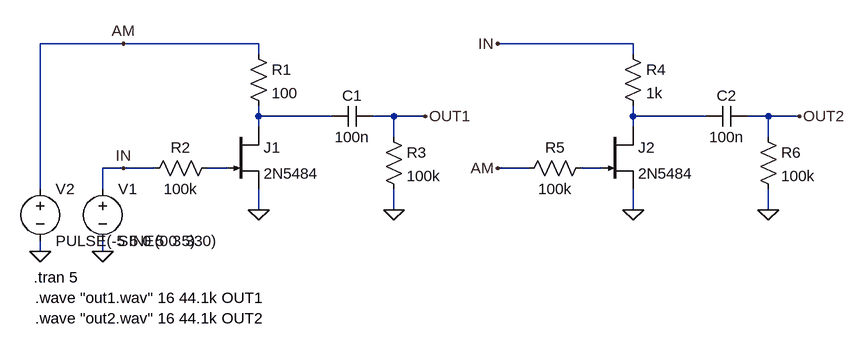
[diagram p0: schematic JFET.asc]
JFET.asc, the LTspice schematic file:
Version 4
SHEET 1 1072 680
WIRE -48 -48 -176 -48
WIRE 160 -48 -48 -48
WIRE 736 -48 528 -48
WIRE 160 -32 160 -48
WIRE 736 -32 736 -48
WIRE 160 64 160 48
WIRE 272 64 160 64
WIRE 368 64 336 64
WIRE 416 64 368 64
WIRE 736 64 736 48
WIRE 848 64 736 64
WIRE 944 64 912 64
WIRE 992 64 944 64
WIRE 160 80 160 64
WIRE 736 80 736 64
WIRE 368 96 368 64
WIRE 944 96 944 64
WIRE -48 144 -80 144
WIRE 0 144 -48 144
WIRE 112 144 80 144
WIRE 576 144 528 144
WIRE 688 144 656 144
WIRE -176 176 -176 -48
WIRE -80 176 -80 144
WIRE 160 208 160 176
WIRE 368 208 368 176
WIRE 736 208 736 176
WIRE 944 208 944 176
WIRE -176 272 -176 256
WIRE -80 272 -80 256
FLAG 160 208 0
FLAG -80 272 0
FLAG -176 272 0
FLAG 416 64 OUT1
FLAG -48 -48 AM
FLAG -48 144 IN
FLAG 368 208 0
FLAG 736 208 0
FLAG 992 64 OUT2
FLAG 528 144 AM
FLAG 528 -48 IN
FLAG 944 208 0
SYMBOL njf 112 80 R0
SYMATTR InstName J1
SYMATTR Value 2N5484
SYMBOL res 144 -48 R0
SYMATTR InstName R1
SYMATTR Value 100
SYMBOL res 96 128 R90
WINDOW 0 0 56 VBottom 2
WINDOW 3 32 56 VTop 2
SYMATTR InstName R2
SYMATTR Value 100k
SYMBOL voltage -80 160 R0
WINDOW 123 0 0 Left 0
WINDOW 39 0 0 Left 0
SYMATTR InstName V1
SYMATTR Value SINE(0 3 330)
SYMBOL voltage -176 160 R0
WINDOW 123 0 0 Left 0
WINDOW 39 0 0 Left 0
SYMATTR InstName V2
SYMATTR Value PULSE(-5 5 0 5 0 5)
SYMBOL cap 336 48 R90
WINDOW 0 0 32 VBottom 2
WINDOW 3 32 32 VTop 2
SYMATTR InstName C1
SYMATTR Value 100n
SYMBOL res 352 80 R0
SYMATTR InstName R3
SYMATTR Value 100k
SYMBOL njf 688 80 R0
SYMATTR InstName J2
SYMATTR Value 2N5484
SYMBOL res 720 -48 R0
SYMATTR InstName R4
SYMATTR Value 1k
SYMBOL res 672 128 R90
WINDOW 0 0 56 VBottom 2
WINDOW 3 32 56 VTop 2
SYMATTR InstName R5
SYMATTR Value 100k
SYMBOL cap 912 48 R90
WINDOW 0 0 32 VBottom 2
WINDOW 3 32 32 VTop 2
SYMATTR InstName C2
SYMATTR Value 100n
SYMBOL res 928 80 R0
SYMATTR InstName R6
SYMATTR Value 100k
TEXT -186 312 Left 2 !.tran 5
TEXT -184 344 Left 2 !.wave "out1.wav" 16 44.1k OUT1\n.wave "out2.wav" 16 44.1k OUT2

The netlist it stands for:
* JFET.asc
J1 N001 N003 0 2N5484
R1 AM N001 100
R2 N003 IN 100k
V1 IN 0 SINE(0 3 330)
V2 AM 0 PULSE(-5 5 0 5 0 5)
C1 OUT1 N001 100n
R3 OUT1 0 100k
J2 N002 N004 0 2N5484
R4 IN N002 1k
R5 N004 AM 100k
C2 OUT2 N002 100n
R6 OUT2 0 100k
.model NJF NJF
.model PJF PJF
.lib standard.jft
.tran 5
.wave "out1.wav" 16 44.1k OUT1
.wave "out2.wav" 16 44.1k OUT2
.backanno
.end